# Altium schematic sheet FLASH.SchDoc
size A4
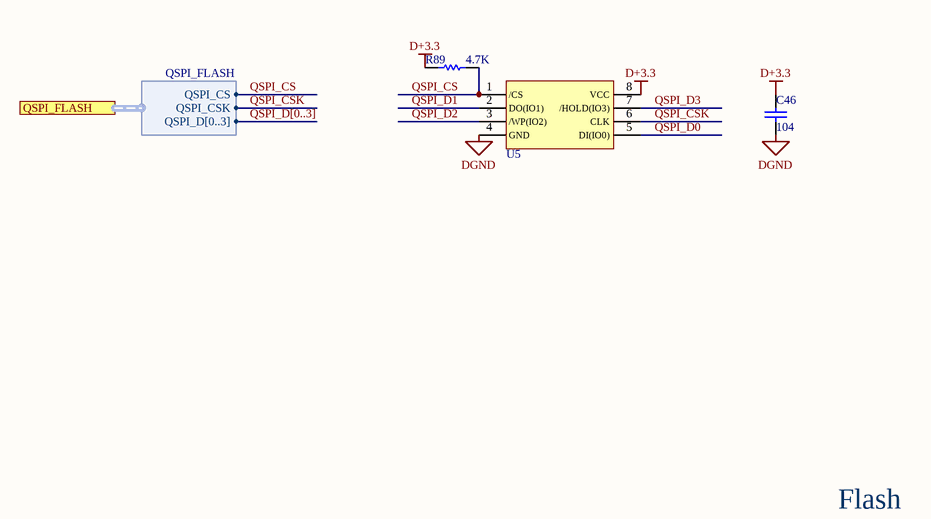
[diagram p0: FLASH.SchDoc]

## Parts
C46  104  [C 0402_LL]
R89  4.7K  [R 0603_L]
U5  W25Q128  [SOP8W_L]  (value not drawn)

## Ports
QSPI_FLASH (harness QSPI_FLASH)

## Harnesses
QSPI_FLASH: QSPI_CS, QSPI_CSK, QSPI_D[0..3]

## Nets
D+3.3: C46.2 R89.2 U5.8(VCC)
DGND: C46.1 U5.4(GND)
QSPI_CS: R89.1 U5.1(/CS) ; port QSPI_FLASH.QSPI_CS
QSPI_CSK: U5.6(CLK) ; port QSPI_FLASH.QSPI_CSK
QSPI_D0: U5.5(DI(IO0))
QSPI_D1: U5.2(DO(IO1))
QSPI_D2: U5.3(/WP(IO2))
QSPI_D3: U5.7(/HOLD(IO3))

## Buses and harness runs
bus QSPI_D[0..3]

## Notes on the sheet
- Flash

## Library data of the parts
C46 = Cap: Capacitor; Published: 8-Jun-2000; LatestRevisionDate: 17-Jul-2002; LatestRevisionNote: Re-released for DXP Platform.; PackageReference: RAD-0.3; Publisher: Altium Limited; PackageDescription: Radial Cap, Thru-Hole; 2 Leads; 0.3 in Pin Spacing
R89 = Res1: Resistor; Value: 1K; Published: 8-Jun-2000; LatestRevisionDate: 17-Jul-2002; LatestRevisionNote: Re-released for DXP Platform.; PackageReference: AXIAL-0.3; Publisher: Altium Limited; PackageDescription: Axial Device, Thru-Hole; 2 Leads; 0.3 in Pin Spacing